# EAGLE design 7-segment (EAGLE 9.3.1)
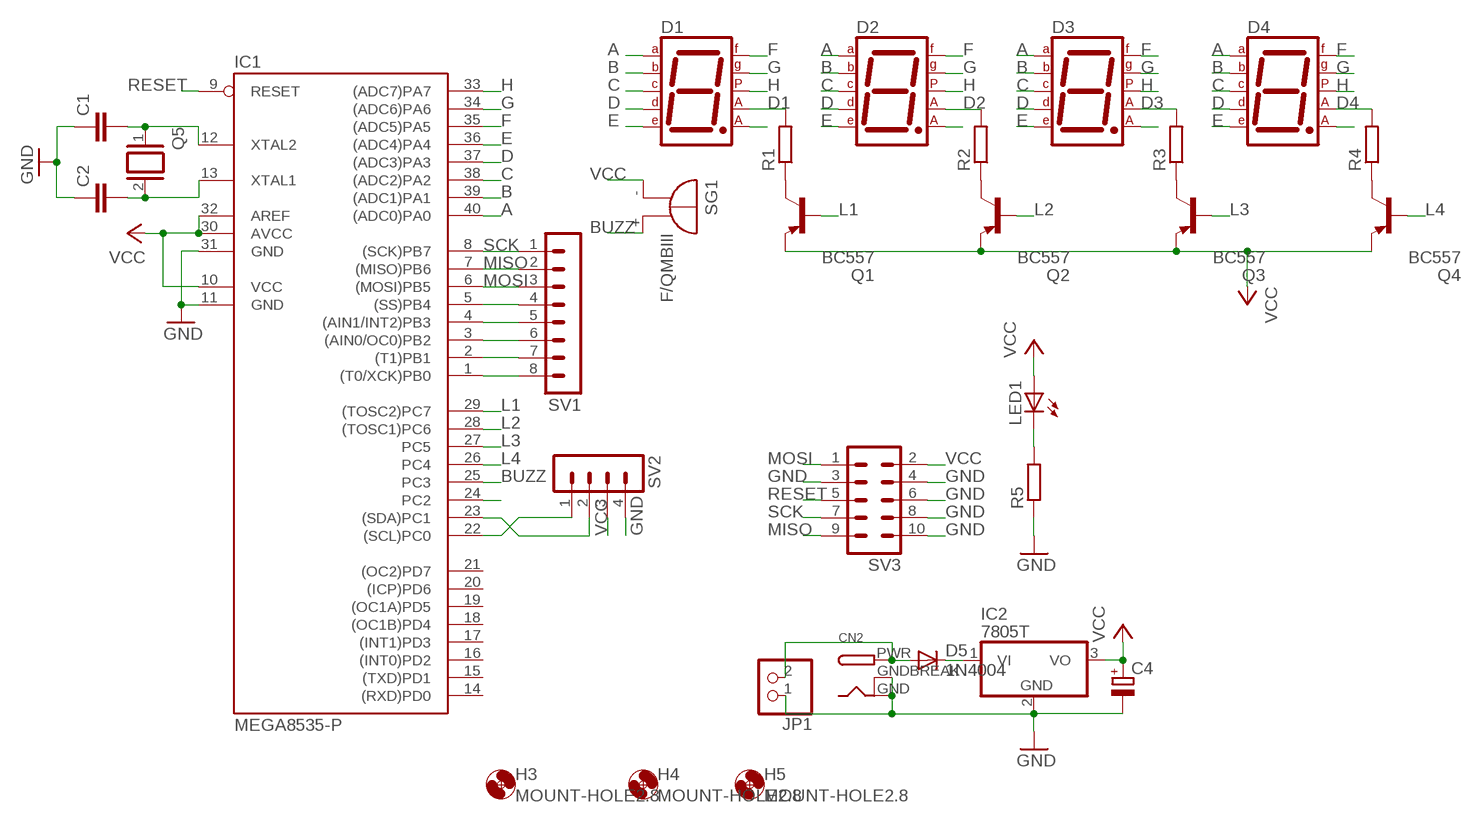
[diagram p0: schematic, sheet 1]

## Parts
C1  C-EU025-024X044  [C025-024X044]
C2  C-EU025-024X044  [C025-024X044]
C4  CPOL-EUE2,5-6E  [E2,5-6E]
CN2  DCBARRELPTH  [DCJACK_2MM_PTH]
D1  7SEG-CA0.8INCH  [7SEG-13]
D2  7SEG-CA0.8INCH  [7SEG-13]
D3  7SEG-CA0.8INCH  [7SEG-13]
D4  7SEG-CA0.8INCH  [7SEG-13]
D5  1N4004  [DO41-10]
H3  MOUNT-HOLE2.8  [2,8]
H4  MOUNT-HOLE2.8  [2,8]
H5  MOUNT-HOLE2.8  [2,8]
IC1  MEGA8535-P  [DIL40]
IC2  7805T  [TO220H]
JP1  PINHD-1X2  [1X02]
LED1  LED3MM  [LED3MM]
Q1  BC557  [TO92-EBC]
Q2  BC557  [TO92-EBC]
Q3  BC557  [TO92-EBC]
Q4  BC557  [TO92-EBC]
Q5  XTAL/S  [QS]
R1  R-EU_0207/7  [0207/7]
R2  R-EU_0207/7  [0207/7]
R3  R-EU_0207/7  [0207/7]
R4  R-EU_0207/7  [0207/7]
R5  R-EU_0207/7  [0207/7]
SG1  F/QMBIII  [F/QMBIII]
SV1  MA08-1  [MA08-1]
SV2  MA04-1  [MA04-1]
SV3  MA05-2  [MA05-2]

## Nets
A: D1.7(A) D2.7(A) D3.7(A) D4.7(A) IC1.40((ADC0)PA0)
B: D1.6(B) D2.6(B) D3.6(B) D4.6(B) IC1.39((ADC1)PA1)
BUZZ: IC1.25(PC3) SG1.+(-)
C: D1.4(C) D2.4(C) D3.4(C) D4.4(C) IC1.38((ADC2)PA2)
D: D1.2(D) D2.2(D) D3.2(D) D4.2(D) IC1.37((ADC3)PA3)
D1: D1.3(CA1) R1.2
D2: D2.3(CA1) R2.2
D3: D3.3(CA1) R3.2
D4: D4.3(CA1) R4.2
E: D1.1(E) D2.1(E) D3.1(E) D4.1(E) IC1.36((ADC4)PA4)
F: D1.9(F) D2.9(F) D3.9(F) D4.9(F) IC1.35((ADC5)PA5)
G: D1.10(G) D2.10(G) D3.10(G) D4.10(G) IC1.34((ADC6)PA6)
GND: C1.1 C2.1 C4.- CN2.GND CN2.GNDBREAK IC1.11(GND) IC1.31(GND) IC2.2(GND) JP1.1 R5.1 SV2.4 SV3.3 SV3.4 SV3.6 SV3.8 SV3.10
H: D1.5(DP) D2.5(DP) D3.5(DP) D4.5(DP) IC1.33((ADC7)PA7)
L1: IC1.29((TOSC2)PC7) Q1.B
L2: IC1.28((TOSC1)PC6) Q2.B
L3: IC1.27(PC5) Q3.B
L4: IC1.26(PC4) Q4.B
MISO: IC1.7((MISO)PB6) SV1.2 SV3.9
MOSI: IC1.6((MOSI)PB5) SV1.3 SV3.1
N$1: Q1.C R1.1
N$2: Q2.C R2.1
N$3: Q3.C R3.1
N$4: Q4.C R4.1
N$5: CN2.PWR D5.A JP1.2
N$6: C1.2 IC1.12(XTAL2) Q5.1
N$7: C2.2 IC1.13(XTAL1) Q5.2
N$8: D5.C IC2.1(VI)
N$10: D1.8(CA2)
N$11: IC1.5((SS)PB4) SV1.4
N$12: IC1.4((AIN1/INT2)PB3) SV1.5
N$13: IC1.3((AIN0/OC0)PB2) SV1.6
N$14: IC1.2((T1)PB1) SV1.7
N$15: IC1.1((T0/XCK)PB0) SV1.8
N$16: LED1.K(C) R5.2
N$20: D2.8(CA2)
N$30: D3.8(CA2)
N$32: IC1.24(PC2)
N$33: IC1.23((SDA)PC1) SV2.2
N$34: IC1.22((SCL)PC0) SV2.1
N$40: D4.8(CA2)
RESET: IC1.9(RESET) SV3.5
SCK: IC1.8((SCK)PB7) SV1.1 SV3.7
VCC: C4.+ IC1.10(VCC) IC1.30(AVCC) IC1.32(AREF) IC2.3(VO) LED1.A Q1.E Q2.E Q3.E Q4.E SG1.-(+) SV2.3 SV3.2
Unconnected: IC1.14((RXD)PD0) IC1.15((TXD)PD1) IC1.16((INT0)PD2) IC1.17((INT1)PD3) IC1.18((OC1B)PD4) IC1.19((OC1A)PD5) IC1.20((ICP)PD6) IC1.21((OC2)PD7)

## Library data of the parts
C1 C2 = rcl_footprint:C-EU: CAPACITOR, European symbol; SPICEPREFIX: C
C4 = rcl:CPOL-EU: POLARIZED CAPACITOR, European symbol; SPICEPREFIX: C
CN2 = adafruit:DCBARREL: 2.0mm DC Barrel Jack DCJACK_2MM_PTH - Through Hole Jack (4UConnector: 05537)
D1-D4 = 7-segment 0.8 inch:7SEG-CA: 7-segment DISPLAY single anode, 13 mm
D5 = adafruit:1N4004: DIODE General purpose 1N400x type rectifier (With bigger pads) http://www.ladyada.net/library/pcb/eaglelibrary.html
H3-H5 = holes:MOUNT-HOLE: MOUNTING HOLE with drill center marker
IC1 = atmel:MEGA8535-P: MICROCONTROLLER 8 Kbytes FLASH 512 bytes SRAM 512 bytes EEPROM USART 8-channel 10 bit ADC Source: avr.lbr; MPN: ATMEGA8535-16PU; OC_FARNELL: 9171444; OC_NEWARK: 01M6909
IC2 = adafruit:78*: Positive VOLTAGE REGULATOR Added bigger pads to the TO-92 package
JP1 = pinhead:PINHD-1X2: PIN HEADER
LED1 = adafruit:LED: LED OSRAM: - CHIPLED LG R971, LG N971, LY N971, LG Q971, LY Q971, LO R971, LY R971 LH N974, LH R974 LS Q976, LO Q976, LY Q976 LO Q996 - Hyper CHIPLED LW Q18S LB Q993, LB Q99A, LB R99A - SideLED LS A670, LO A670, LY A670, LG A670, LP A670 LB A673, LV A673, LT A673, LW A673 LH A674 LY A675 LS A676, LA A676, LO A676, LY A676, LW A676 LS A679, LY A679, LG A679 - Hyper Micro SIDELED® LS Y876, LA Y876, LO Y876, LY Y876 LT Y87S - SmartLED LW L88C, LW L88S LB L89C, LB L89S, LG L890 LS L89K, LO L89K, LY L89K LS L896, LA L896, LO L896, LY L896 - TOPLED LS T670, LO T670, LY T670, LG T670, LP T670 LSG T670, LSP T670, LSY T670, LOP T670, LYG T670 LG T671, LOG T671, LSG T671 LB T673, LV T673, LT T673, LW T673 LH T674 LS T676, LA T676, LO T676, LY T676, LB T676, LH T676, LSB T676, LW T676 LB T67C, LV T67C, LT T67C, LS T67K, LO T67K, LY T67K, LW E67C LS E67B, LA E67B, LO E67B, LY E67B, LB E67C, LV E67C, LT E67C LW T67C LS T679, LY T679, LG T679 LS T770, LO T770, LY T770, LG T770, LP T770 LB T773, LV T773, LT T773, LW T773 LH T774 LS E675, LA E675, LY E675, LS T675 LS T776, LA T776, LO T776, LY T776, LB T776 LHGB T686 LT T68C, LB T68C - Hyper Mini TOPLED® LB M676 - Mini TOPLED Santana® LG M470 LS M47K, LO M47K, LY M47K Source: http://www.osram.convergy.de/
Q1-Q4 = transistor-pnp:BC557*: PNP Transistror
Q5 = special:XTAL/S: CRYSTAL
R1-R4 = rcl:R-EU_: RESISTOR, European symbol; SPICEPREFIX: R
R5 = rcl_footprint:R-EU_: RESISTOR, European symbol; SPICEPREFIX: R
SG1 = buzzer:F/QMBIII: BUZZER Source: Buerklin; OC_FARNELL: unknown; OC_NEWARK: unknown
SV1 = con-lstb:MA08-1: PIN HEADER; OC_FARNELL: unknown; OC_NEWARK: unknown
SV2 = con-lstb:MA04-1: PIN HEADER; OC_FARNELL: unknown; OC_NEWARK: unknown
SV3 = con-lstb:MA05-2: PIN HEADER; OC_FARNELL: unknown; OC_NEWARK: unknown

## Board
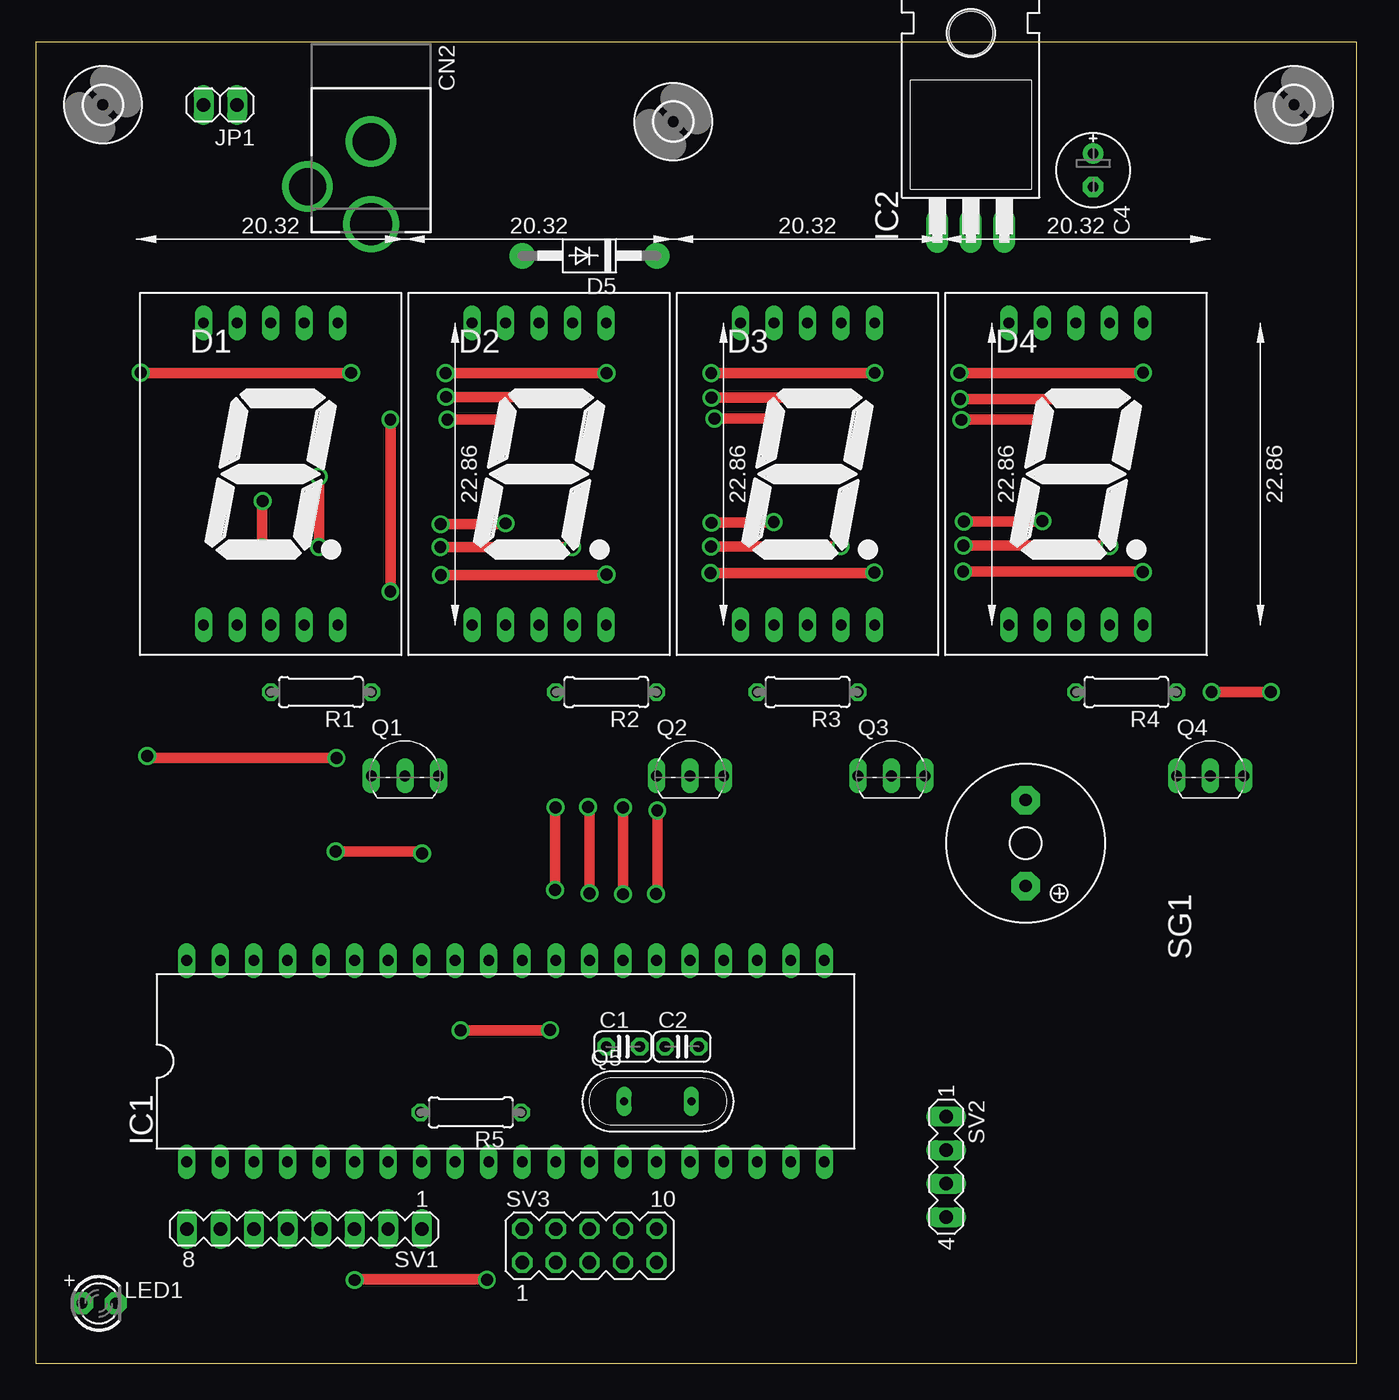
[diagram p1: board, top side]
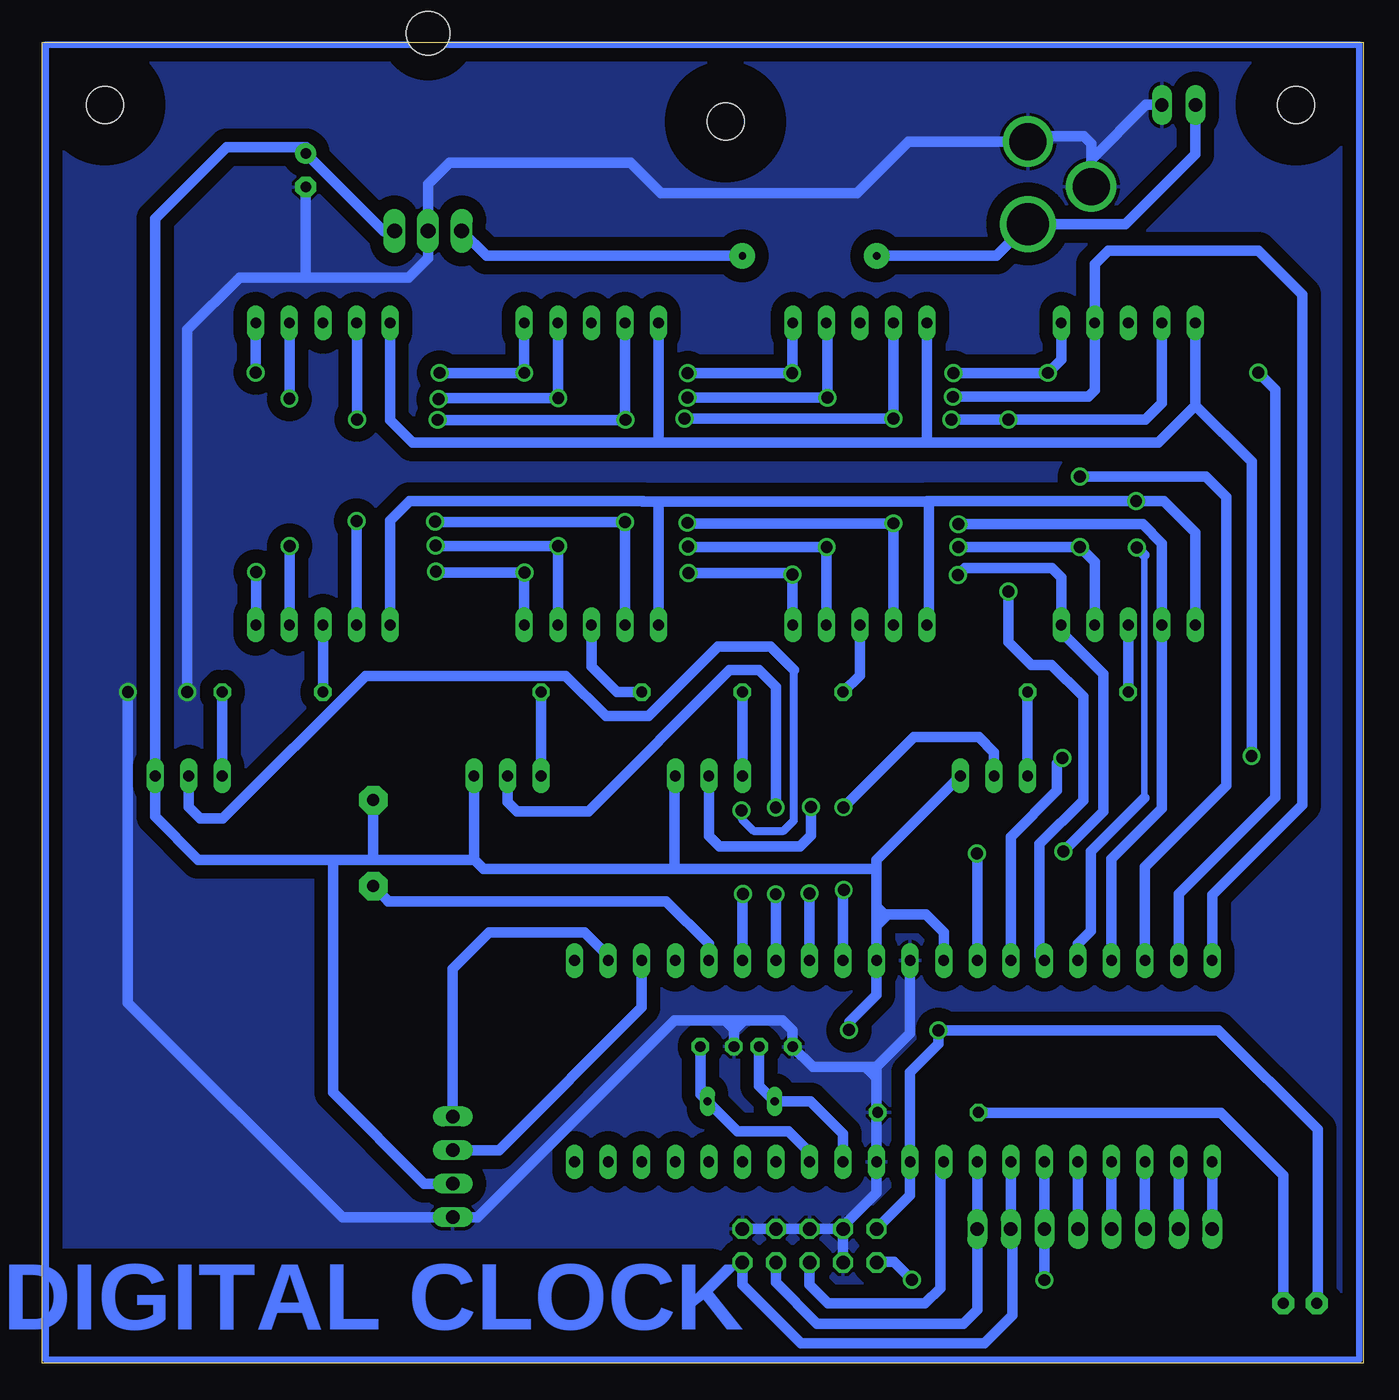
[diagram p2: board, bottom side, seen from below]

Size 100 x 100 mm. Coordinates in mm from the lower left corner, seen from the top.
Outline: 0,0 100,0 100,100 0,100 0,0
Copper layers (1*16): Top 0.035mm / dielectric 1.5mm / Bottom 0.035mm
Design rules "default": minimum track width 6mil, minimum drill 0.35mm, track to track 6mil, track to pad 6mil, pad to pad 6mil, via to via 6mil, smd to smd 6mil, copper to edge 40mil, drill to drill 6mil, minimum pad ring 10mil, minimum via ring 8mil, stop-mask expansion 4mil, vias tented up to drill 0mil, thermal gap 10mil

### Footprints (pad centres in the part's own frame; a part is rotated, then mirrored left to right if it is on the bottom)
C025-024X044 = drill 0.813 octagon: 1 -1.27,0; 2 1.27,0
E2,5-6E = drill 0.813 pad 1.575: + -1.27,0 | drill 0.813 pad 1.575 octagon: - 1.27,0
DCJACK_2MM_PTH = drill 2.8: GND 0,7.35; GNDBREAK 4.8,10.75 | drill 3.2: PWR 0,13.6
7SEG-13 = drill 0.813 long: 1 -5.08,-11.43; 2 -2.54,-11.43; 3 0,-11.43; 4 2.54,-11.43; 5 5.08,-11.43; 6 5.08,11.43; 7 2.54,11.43; 8 0,11.43; 9 -2.54,11.43; 10 -5.08,11.43
DO41-10 = drill 0.55 pad 1.93: A 5.08,0; C -5.08,0
2,8 = hole 2.8: 0,0
DIL40 = drill 0.813 long: 1 -24.13,-7.62; 2 -21.59,-7.62; 3 -19.05,-7.62; 4 -16.51,-7.62; 5 -13.97,-7.62; 6 -11.43,-7.62; 7 -8.89,-7.62; 8 -6.35,-7.62; 9 -3.81,-7.62; 10 -1.27,-7.62; 11 1.27,-7.62; 12 3.81,-7.62; 13 6.35,-7.62; 14 8.89,-7.62; 15 11.43,-7.62; 16 13.97,-7.62; 17 16.51,-7.62; 18 19.05,-7.62; 19 21.59,-7.62; 20 24.13,-7.62; 21 24.13,7.62; 22 21.59,7.62; 23 19.05,7.62; 24 16.51,7.62; 25 13.97,7.62; 26 11.43,7.62; 27 8.89,7.62; 28 6.35,7.62; 29 3.81,7.62; 30 1.27,7.62; 31 -1.27,7.62; 32 -3.81,7.62; 33 -6.35,7.62; 34 -8.89,7.62; 35 -11.43,7.62; 36 -13.97,7.62; 37 -16.51,7.62; 38 -19.05,7.62; 39 -21.59,7.62; 40 -24.13,7.62
TO220H = drill 1.118 long: 1 -2.54,-10.16; 2 0,-10.16; 3 2.54,-10.16 | hole 3.302: 0,4.826
1X02 = drill 1.016 long: 1 -1.27,0; 2 1.27,0
LED3MM = drill 0.813 pad 1.676 octagon: A -1.27,0; K 1.27,0
TO92-EBC = drill 0.813 long: B 0,-1.27; C -2.54,-1.27; E 2.54,-1.27
QS = drill 0.61 long: 1 -2.54,0; 2 2.54,0
0207/7 = drill 0.813 octagon: 1 -3.81,0; 2 3.81,0
F/QMBIII = drill 0.914 pad 2.159 octagon: + 3.251,0; - -3.251,0
MA08-1 = drill 1.016 long: 1 -8.89,0; 2 -6.35,0; 3 -3.81,0; 4 -1.27,0; 5 1.27,0; 6 3.81,0; 7 6.35,0; 8 8.89,0
MA04-1 = drill 1.016 long: 1 -3.81,0; 2 -1.27,0; 3 1.27,0; 4 3.81,0
MA05-2 = drill 1.016 octagon: 1 -5.08,-1.27; 2 -5.08,1.27; 3 -2.54,-1.27; 4 -2.54,1.27; 5 0,-1.27; 6 0,1.27; 7 2.54,-1.27; 8 2.54,1.27; 9 5.08,-1.27; 10 5.08,1.27

### Placement (x,y rotation side)
C1  44.45,23.96 0 top
C2  48.9,23.97 0 top
C4  80.04,90.3 270 top
CN2  25.38,99.82 180 top
D1  17.78,67.31 0 top
D2  38.1,67.31 0 top
D3  58.42,67.31 0 top
D4  78.74,67.31 0 top
D5  41.91,83.82 180 top
H3  5.08,95.25 0 top
H4  95.25,95.25 0 top
H5  48.26,93.98 0 top
IC1  35.56,22.86 0 top
IC2  70.78,95.86 0 top
JP1  13.97,95.25 180 top
LED1  4.78,4.53 0 top
Q1  27.94,45.72 0 top
Q2  49.53,45.72 0 top
Q3  64.77,45.72 0 top
Q4  88.9,45.72 0 top
Q5  47.08,19.82 0 top
R1  21.59,50.8 180 top
R2  43.18,50.8 180 top
R3  58.42,50.8 180 top
R4  82.55,50.8 180 top
R5  32.93,18.98 180 top
SG1  74.93,39.37 270 top
SV1  20.32,10.16 180 top
SV2  68.91,14.86 270 top
SV3  41.91,8.89 0 top

### Tracks (layer width: path | path; a pad name or v marks a point on that pad's centre or on a via)
A  (via drill 0.9)
  Top 0.813: v31.06,73.14 40.48,73.14 v40.55,73.07 | v51.15,73.07 60.9,73.07 v60.93,73.05 | v69.97,72.98 81.25,72.98 v81.28,73
  Bottom 0.813: v31.06,73.14 31.03,73.17 20.8,73.17 20.32,73.65 D1.7 20.32,83.2 19.29,84.23 7.95,84.23 4.59,80.87 4.59,42.26 11.43,35.42 IC1.40 | v51.15,73.07 v40.55,73.07 40.55,78.66 D2.7 | v69.97,72.98 69.9,73.05 v60.93,73.05 60.96,73.08 D3.7 | v81.28,73 D4.7
B  (via drill 0.9)
  Top 0.813: v31.03,74.94 v43.22,74.94 | v51.13,74.93 63.47,74.93 v63.5,74.96 | v69.91,74.96 83.79,74.96 v83.82,74.99 | v23.86,74.96 7.98,74.96 v7.95,74.99
  Bottom 0.813: D1.6 22.86,75.96 v23.86,74.96 31.01,74.96 v31.03,74.94 | v51.13,74.93 v51.12,74.94 v43.22,74.94 43.22,78.7 D2.6 | v69.91,74.96 v63.5,74.96 D3.6 | v83.82,74.99 D4.6 | D3.6 | v7.95,74.99 6.65,73.7 6.65,42.83 13.97,35.51 IC1.39
BUZZ
  Bottom 0.813: IC1.25 49.53,31.72 52.78,34.97 73.8,34.97 73.8,34.99 SG1.+
C  (via drill 0.9)
  Top 0.813: v30.63,61.77 v40.61,61.77 | v51.12,61.81 60.89,61.81 v60.93,61.85 | v70.21,61.89 81.21,61.89 v81.25,61.85 | v21.43,67.1 v21.43,61.77
  Bottom 0.813: D1.4 20.32,60.66 v21.43,61.77 v30.63,61.77 | v51.12,61.81 51.08,61.77 v40.61,61.77 40.64,61.73 D2.4 | v70.21,61.89 70.17,61.85 v60.93,61.85 60.96,61.82 D3.4 | v81.25,61.85 81.25,55.91 D4.4 | IC1.38 16.51,37.58 10.36,43.73 10.36,65.54 11.92,67.1 v21.43,67.1
D  (via drill 0.9)
  Top 0.813: v30.64,63.5 35.5,63.5 v35.57,63.57 | v51.16,63.62 55.8,63.62 v55.86,63.68 | v70.25,63.7 76.16,63.7 v76.2,63.74
  Bottom 0.813: v30.64,63.5 16.69,63.5 15.24,62.05 D1.2 15.24,42 19.05,38.19 IC1.37 | v51.16,63.62 51.11,63.57 v35.57,63.57 v35.56,63.56 D2.2 | v70.25,63.7 70.23,63.68 v55.86,63.68 55.88,63.66 D3.2 | v76.2,63.74 D4.2
D1
  Bottom 0.813: R1.2 D1.3
D2
  Bottom 0.813: R2.2 38.1,52.07 D2.3
D3
  Bottom 0.813: R3.2 56.49,50.8 58.42,52.73 D3.3
D4
  Bottom 0.813: D4.3 R4.2
E  (via drill 0.9)
  Top 0.813: v17.13,61.73 17.13,65.2 v17.19,65.25
  Bottom 0.508: 16.56,42.78 16.56,61.16
  Bottom 0.813: 54.52,65.26 72.17,65.26 73.66,63.77 D4.1 | 32.86,65.15 32.86,56.04 D2.1 | 32.86,65.15 32.86,65.17 32.8,65.23 53.34,65.23 53.34,65.22 | 32.86,65.15 32.97,65.25 v17.19,65.25 15.09,65.25 12.7,62.86 D1.1 12.71,55.87 | D3.1 53.34,65.22 | 54.55,65.22 54.52,65.26 | IC1.36 21.59,31.75 20.61,32.73 20.61,38.73 16.56,42.78 | 16.56,61.16 v17.13,61.73 | 53.34,65.22 54.48,65.22 54.52,65.26
F  (via drill 0.9)
  Top 0.813: v31.16,71.44 35.5,71.44 v35.57,71.5 | v51.37,71.5 55.74,71.5 v55.85,71.4 | v70.07,71.4 70.11,71.44 v76.16,71.44 | v26.85,58.42 v26.85,71.44
  Bottom 0.813: D1.9 15.24,72.68 16.48,71.44 19.01,71.44 v26.85,71.44 v31.16,71.44 | v51.37,71.5 v35.57,71.5 v35.56,71.51 D2.9 | v70.07,71.4 v55.85,71.4 55.88,71.43 D3.9 | v76.16,71.44 76.16,78.7 D4.9 | IC1.35 24.51,30.86 24.51,39.29 21.19,42.6 21.19,50.46 23.59,52.86 25.13,52.86 26.85,54.58 v26.85,58.42
G  (via drill 0.9)
  Top 0.813: v22.76,45.82 22.75,45.81 8.6,45.81 v8.45,45.96
  Bottom 0.813: IC1.34 26.67,39.85 23.17,43.34 23.17,45.41 v22.76,45.82 | D1.10 12.7,72.48 | D4.10 73.66,71.37 71.96,69.67 53.42,69.67 | 12.7,72.48 15.51,69.67 32.97,69.67 | 32.97,69.67 53.42,69.67 | D3.10 53.34,69.75 53.42,69.67 | D2.10 33.02,69.72 32.97,69.67 | v8.45,45.96 8.45,68.23 12.7,72.48
GND  (via drill 0.9)
  Top 0.813: v89,50.82 v93.5,50.82
  Bottom 0.813: 36.83,18.96 IC1.11 36.83,12.89 39.37,10.35 SV3.4 | 36.83,18.96 36.83,21.58 | 36.83,21.58 36.83,22.44 | IC1.31 34.29,24.98 36.83,22.44 | 37.52,22.44 41.66,22.44 C1.1 43.18,25.2 43.95,25.96 46.87,25.96 | 37.52,22.44 36.83,22.44 | 46.87,25.96 47.67,25.96 | 47.63,25.27 C2.1 | 47.71,25.93 47.67,25.96 | SV3.3 SV3.4 | SV3.10 SV3.8 SV3.6 SV3.4 | 36.83,21.58 37.52,22.27 37.52,22.44 | 46.87,25.96 47.56,25.27 47.63,25.27 | 47.63,25.27 48.31,25.95 | 48.31,25.95 52.14,25.95 67.04,11.05 SV2.4 77.27,11.05 93.5,27.28 v93.5,50.82 | 47.67,25.96 48.3,25.96 48.31,25.95 | v89,50.82 89,78.22 85.04,82.18 80.01,82.18 | JP1.1 16.44,95.25 20.58,91.11 CN2.GNDBREAK 20.58,92.31 21.14,92.88 24.97,92.88 CN2.GND 34.42,92.47 38.32,88.57 53.15,88.57 55.44,90.87 69.16,90.87 70.78,89.25 IC2.2 70.78,83.64 72.25,82.18 80.01,82.18 | C4.- 80.04,82.21 80.01,82.18 | R5.1 36.77,18.96 36.83,18.96
  pour Bottom (isolate 1.016): 0,100.33 0,0 100.33,0 100.33,100.33
H  (via drill 0.9)
  Top 0.813: v30.67,59.66 43.18,59.66 v43.21,59.69 | v51.07,59.8 63.41,59.8 v63.47,59.86 | v70.2,59.91 83.76,59.91 v83.79,59.88 | v29.23,38.6 29.09,38.74 v22.71,38.74
  Bottom 0.813: v30.67,59.66 30.14,60.18 23.57,60.18 22.86,59.47 D1.5 22.86,55.35 19.67,52.16 19.67,41.77 v22.71,38.74 | v51.07,59.8 43.32,59.8 v43.21,59.69 43.21,55.91 D2.5 | v70.2,59.91 70.14,59.86 v63.47,59.86 63.5,59.83 D3.5 | v83.79,59.88 83.79,55.91 D4.5 | IC1.33 29.21,38.57 v29.23,38.6
L1  (via drill 0.9)
  Top 0.813: v39.32,35.83 39.32,42.06 v39.34,42.08
  Bottom 0.813: IC1.29 39.37,35.78 v39.32,35.83 | v39.34,42.08 34.02,47.39 29.1,47.39 27.94,46.24 Q1.B
L2  (via drill 0.9)
  Top 0.813: v41.92,35.57 41.92,41.97 v41.79,42.1
  Bottom 0.813: IC1.28 41.91,35.56 v41.92,35.57 | v41.79,42.1 41.79,39.95 42.63,39.12 48.72,39.12 49.53,39.92 Q2.B
L3  (via drill 0.9)
  Top 0.813: v44.47,35.5 v44.47,42.07
  Bottom 0.813: IC1.27 44.45,35.48 v44.47,35.5 | v44.47,42.07 44.47,51.2 45.73,52.46 47.97,52.46 58.64,41.78 64.05,41.78 64.77,42.5 Q3.B
L4  (via drill 0.9)
  Top 0.813: v46.95,35.52 47.05,35.62 v47.05,41.83
  Bottom 0.61: v47.05,41.83 47.05,41.21 46.13,40.3 43.87,40.3 43.09,41.07 43.09,52.45
  Bottom 0.813: IC1.26 46.99,35.48 v46.95,35.52 | Q4.B 88.9,42.09 88.03,41.22 86.32,41.22 75.53,52.02 60.37,52.02 57.32,48.97 54.09,48.97 48.82,54.24 44.88,54.24 43.09,52.45
MISO
  Bottom 0.813: IC1.7 SV1.2 26.56,10.05 26.56,3.62 28.67,1.51 42.55,1.51 46.99,5.95 SV3.9
MOSI  (via drill 0.9)
  Top 0.813: v24.14,6.29 24.21,6.36 34.1,6.36 v34.15,6.31
  Bottom 0.813: IC1.6 SV1.3 24.13,6.3 v24.14,6.29 | v34.15,6.31 35.52,7.68 36.77,7.68 SV3.1
N$1
  Bottom 0.813: R1.1 Q1.C
N$2
  Bottom 0.813: R2.1 Q2.C
N$3
  Bottom 0.813: R3.1 Q3.C
N$4
  Bottom 0.813: R4.1 Q4.C
N$5
  Bottom 0.813: JP1.2 12.7,91.52 18,86.22 CN2.PWR 27.78,83.82 D5.A
N$6
  Bottom 0.813: C1.2 45.72,21 Q5.1 41.84,19.82 39.37,17.35 IC1.12
N$7
  Bottom 0.813: C2.2 50.17,20.36 Q5.2 47.35,17.54 43.5,17.54 41.91,15.95 IC1.13
N$8
  Bottom 0.813: D5.C 66.36,83.82 IC2.1
N$9
  Bottom 0.508: 0.3,99.79 0.3,0.26 99.74,0.26 99.74,99.79 0.3,99.79
N$11
  Bottom 0.813: IC1.5 SV1.4
N$12
  Bottom 0.813: SV1.5 IC1.4
N$13
  Bottom 0.813: IC1.3 SV1.6
N$14
  Bottom 0.813: SV1.7 IC1.2
N$15
  Bottom 0.813: IC1.1 SV1.8
N$16
  Bottom 0.813: LED1.K 6.05,14.23 10.76,18.94 29.08,18.94 R5.2
N$33
  Bottom 0.813: IC1.23 54.61,26.93 65.41,16.13 SV2.2
N$34
  Bottom 0.813: SV2.1 68.91,29.86 66.16,32.62 58.92,32.62 57.15,30.84 IC1.22
RESET
  Bottom 0.813: SV3.5 41.91,5.93 40.51,4.52 33.17,4.52 32.01,5.68 32.01,14.98 IC1.9
SCK
  Bottom 0.813: IC1.8 SV1.1 29.21,4.05 30.27,2.98 41.33,2.98 44.45,6.11 SV3.7
VCC  (via drill 0.9)
  Top 0.813: v38.93,25.21 38.91,25.2 v32.15,25.2
  Bottom 0.813: 36.83,33.1 IC1.30 36.83,27.88 38.89,25.82 38.89,25.25 v38.93,25.21 | 36.83,33.1 36.83,33.96 | 36.83,33.96 36.83,34.56 | 36.83,34.56 36.83,37.43 | 36.83,37.43 36.83,38.1 Q1.E | 36.83,37.43 51.84,37.43 | Q2.E 52.13,44.39 52.13,37.43 | 52.13,37.43 66.6,37.43 67.27,38.1 | Q3.E 67.31,38.14 67.27,38.1 | 67.27,38.1 74.93,38.1 | 74.93,38.1 77.99,38.1 | 77.99,38.1 88.17,38.1 91.44,41.37 Q4.E 91.44,86.63 86.02,92.05 80.01,92.05 80.01,91.61 C4.+ 74.17,85.7 IC2.3 | SG1.- 74.93,38.1 | SV2.3 71.07,13.59 77.99,20.5 77.99,38.1 | 51.84,37.43 | 51.84,37.43 52.13,37.43 | IC1.32 31.75,32.6 33.1,33.96 35.97,33.96 | 36.23,33.96 36.83,33.96 | 36.83,34.56 36.23,33.96 | 36.23,33.96 35.97,33.96 | 35.97,33.96 36.83,33.1 | SV3.2 34.29,12.7 IC1.10 34.29,22.03 32.15,24.17 v32.15,25.2 10.95,25.2 3.45,17.7 3.45,4.59 LED1.A

### Text on the board
Bottom: DIGITAL CLOCK